# EAGLE schematic output (EAGLE 7.6.0)
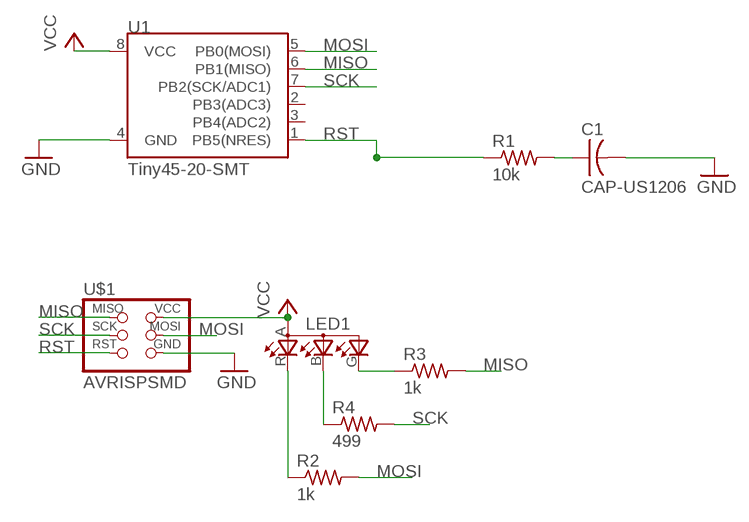
[diagram p0: schematic, sheet 1]

## Parts
C1  CAP-US1206  [C1206]
LED1  LEDRGBOLD  [P-LCC-4-3]
R1  10k  R-US_M1206  [M1206]
R2  1k  R-US_M1206  [M1206]
R3  1k  R-US_M1206  [M1206]
R4  499  R-US_M1206  [M1206]
U1  Tiny45-20-SMT  ATTINY45TINY45-20-SMT  [SO08-EIAJ]
U$1  AVRISPSMD  [2X03SMD]

## Nets
GND: C1.2 U1.4(GND) U$1.6(GND)
MISO: R3.2 U1.6(PB1(MISO)) U$1.1(MISO)
MOSI: R2.2 U1.5(PB0(MOSI)) U$1.4(MOSI)
N$1: C1.1 R1.2
N$3: LED1.R(CRED) R2.1
N$6: LED1.G(CGREEN) R3.1
N$10: LED1.B(CBLUE) R4.1
RST: R1.1 U1.1(PB5(NRES)) U$1.5(RST)
SCK: R4.2 U1.7(PB2(SCK/ADC1)) U$1.3(SCK)
VCC: LED1.A(A2) U1.8(VCC) U$1.2(VCC)
Unconnected: U1.2(PB3(ADC3)) U1.3(PB4(ADC2))

## Library data of the parts
C1 = fab:CAP-US
LED1 = fab:LEDRGBOLD: OSRAM Hyper Multi TOPLED® Hyper-Bright LED LATB T686 Source: http://www.osram.convergy.de/
R1-R4 = resistor:R-US_: RESISTOR, American symbol
U1 = SparkFun-DigitalIC:ATTINY45: Atmel 8-pin 2/4/8kB flash uC; PROD_ID: IC-08922
U$1 = fab:AVRISP